# EAGLE design rgxb (EAGLE 5.11)
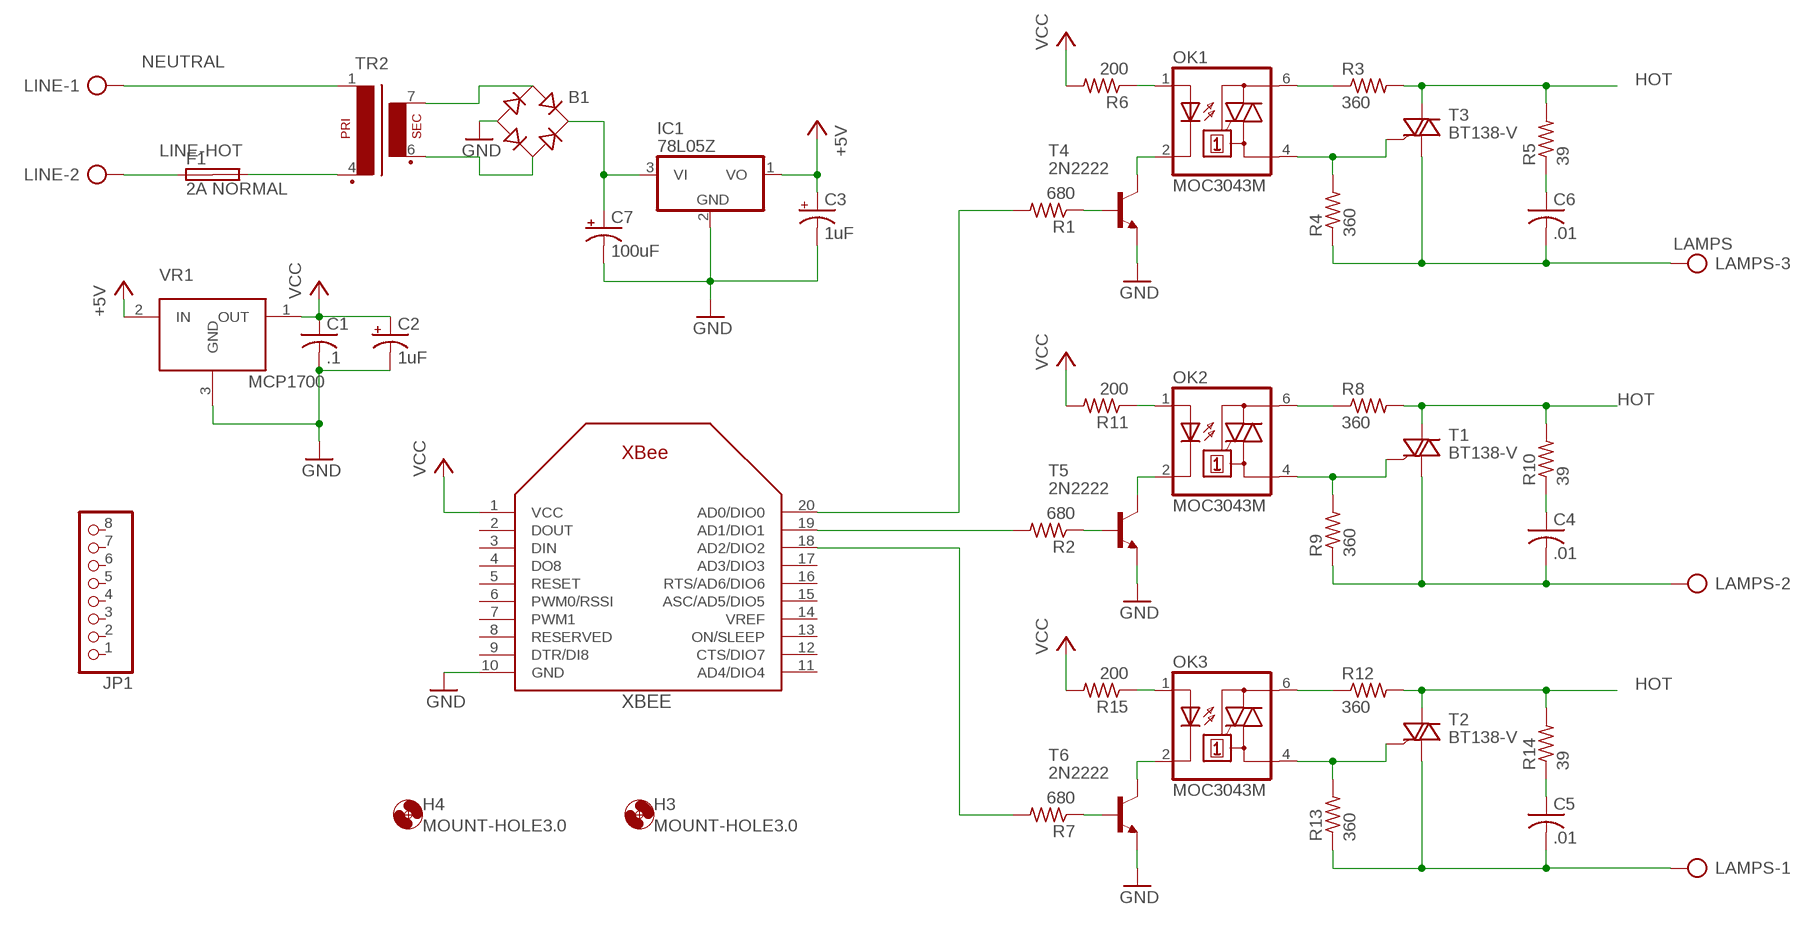
[diagram p0: schematic, sheet 1]

## Parts
B1  RB1A  [RB1A]
C1  .1  C-US025-025X050  [C025-025X050]
C2  1uF  CPOL-USE2.5-5  [E2,5-5]
C3  1uF  CPOL-USE2.5-5  [E2,5-5]
C4  .01  C-US050-025X075  [C050-025X075]
C5  .01  C-US050-025X075  [C050-025X075]
C6  .01  C-US050-025X075  [C050-025X075]
C7  100uF  CPOL-USE5-10.5  [E5-10,5]
F1  2A NORMAL  SH32  [SH32]
H3  MOUNT-HOLE3.0  [3,0]
H4  MOUNT-HOLE3.0  [3,0]
IC1  78L05Z  [TO92]
JP1  PINHD-1X8  [1X08]
LAMPS  LAMPS  AK300/3  [AK300/3]
LINE  AK300/2  [AK300/2]
OK1  MOC3043M  [DIL06]
OK2  MOC3043M  [DIL06]
OK3  MOC3043M  [DIL06]
R1  680  R-US_0204/5  [0204/5]
R2  680  R-US_0204/5  [0204/5]
R3  360  R-US_0204/5  [0204/5]
R4  360  R-US_0309/10  [0309/10]
R5  39  R-US_0204/5  [0204/5]
R6  200  R-US_0204/5  [0204/5]
R7  680  R-US_0204/5  [0204/5]
R8  360  R-US_0204/5  [0204/5]
R9  360  R-US_0309/10  [0309/10]
R10  39  R-US_0204/5  [0204/5]
R11  200  R-US_0204/5  [0204/5]
R12  360  R-US_0204/5  [0204/5]
R13  360  R-US_0309/10  [0309/10]
R14  39  R-US_0204/5  [0204/5]
R15  200  R-US_0204/5  [0204/5]
T1  BT138-V  [TO220BV]
T2  BT138-V  [TO220BV]
T3  BT138-V  [TO220BV]
T4  2N2222  2N2222-NPN-TO92-EBC  [TO92-EBC]
T5  2N2222  2N2222-NPN-TO92-EBC  [TO92-EBC]
T6  2N2222  2N2222-NPN-TO92-EBC  [TO92-EBC]
TR2  EE20-1  [EE20-1]
VR1  MCP1700  [TO-92]
XBEE  XBEE  [XBEE]

## Nets
+5V: C3.+ IC1.1(VO) VR1.2(IN)
GND: B1.- C1.2 C2.- C3.- C7.- IC1.2(GND) T4.E T5.E T6.E VR1.3(GND) XBEE.10(GND)
HOT: F1.2A R3.2 R5.2 R8.2 R10.2 R12.2 R14.2 T1.T2(A2) T2.T2(A2) T3.T2(A2) TR2.4(P2)
LINE-HOT: F1.1A LINE.2
N$1: OK1.1(A) R6.1
N$2: OK1.6(A2) R3.1
N$3: OK1.4(A1) R4.2 T3.G
N$4: R1.2 XBEE.20(AD0/DIO0)
N$5: R2.2 XBEE.19(AD1/DIO1)
N$6: C6.2 LAMPS.3 R4.1 T3.T1(A1)
N$7: B1.AC1 TR2.7(S4)
N$8: B1.AC2 TR2.6(S3)
N$9: R1.1 T4.B
N$10: C6.1 R5.1
N$11: OK1.2(C) T4.C
N$12: R2.1 T5.B
N$13: OK2.1(A) R11.1
N$14: R7.2 XBEE.18(AD2/DIO2)
N$15: OK2.6(A2) R8.1
N$16: OK2.4(A1) R9.2 T1.G
N$17: C4.2 LAMPS.2 R9.1 T1.T1(A1)
N$18: C4.1 R10.1
N$19: OK3.1(A) R15.1
N$20: OK3.6(A2) R12.1
N$21: R7.1 T6.B
N$22: OK3.4(A1) R13.2 T2.G
N$23: C5.2 LAMPS.1 R13.1 T2.T1(A1)
N$24: C5.1 R14.1
N$25: OK3.2(C) T6.C
N$26: OK2.2(C) T5.C
NEUTRAL: LINE.1 TR2.1
SOURCE+: B1.+ C7.+ IC1.3(VI)
VCC: C1.1 C2.+ R6.2 R11.2 R15.2 VR1.1(OUT) XBEE.1(VCC)
Unconnected: F1.1B F1.2B JP1.1 JP1.2 JP1.3 JP1.4 JP1.5 JP1.6 JP1.7 JP1.8 XBEE.2(DOUT) XBEE.3(DIN) XBEE.4(DO8) XBEE.5(RESET) XBEE.6(PWM0/RSSI) XBEE.7(PWM1) XBEE.8(RESERVED) XBEE.9(DTR/DI8) XBEE.11(AD4/DIO4) XBEE.12(CTS/DIO7) XBEE.13(ON/SLEEP) XBEE.14(VREF) XBEE.15(ASC/AD5/DIO5) XBEE.16(RTS/AD6/DIO6) XBEE.17(AD3/DIO3)

## Library data of the parts
B1 = rectifier:RB1A: RECTIFIER 1 A
C1 = rcl-ez:C-US: CAPACITOR, American symbol
C2 C3 = rcl-ez:CPOL-US: POLARIZED CAPACITOR, American symbol
C4-C6 = rcl:C-US: CAPACITOR, American symbol
C7 = rcl:CPOL-US: POLARIZED CAPACITOR, American symbol
F1 = fuse:SH32: FUSE HOLDER 6 x 32 mm, SH contact, SHH3N Schukat, 102071 Wickmann (Buerklin); MPN: 10207101009; OC_FARNELL: 811786; OC_NEWARK: 76R6904
H3 H4 = holes:MOUNT-HOLE: MOUNTING HOLE with drill center marker
IC1 = linear:78*: Positive VOLTAGE REGULATOR Source: http://cache.national.com/ds/LM/LM78L05.pdf http://www.fairchildsemi.com/ds/LM/LM7805.pdf
JP1 = pinhead:PINHD-1X8: PIN HEADER
LAMPS = con-ptr500:AK300/3: CONNECTOR; OC_FARNELL: unknown; OC_NEWARK: unknown
LINE = con-ptr500:AK300/2: CONNECTOR; OC_FARNELL: unknown; OC_NEWARK: unknown
OK1-OK3 = optocoupler:MOC30*: 6-Pin DIP Zero-Cross Optoisolators Triac Driver Output (250/400 Volt Peak) Source: http://www.fairchildsemi.com/ds/MO/MOC3043-M.pdf
R1 R2 R5-R7 R10 R11 R14 R15 = rcl:R-US_: RESISTOR, American symbol
R3 R4 R8 R9 R12 R13 = resistor:R-US_: RESISTOR, American symbol
T1-T3 = triac:BT138: TRIAC Source: http://www.semiconductors.philips.com BT138_SERIES_2.pdf
T4-T6 = transistor-neu-to92:*-NPN-: NPN Transistror
TR2 = trafo:EE20-1: TRANSFORMER 1 primary winding, 1 secondary winding ERA
VR1 = merriman:MCP1700: Microchip LDO regulator
XBEE = ulink:XBEE

## Board
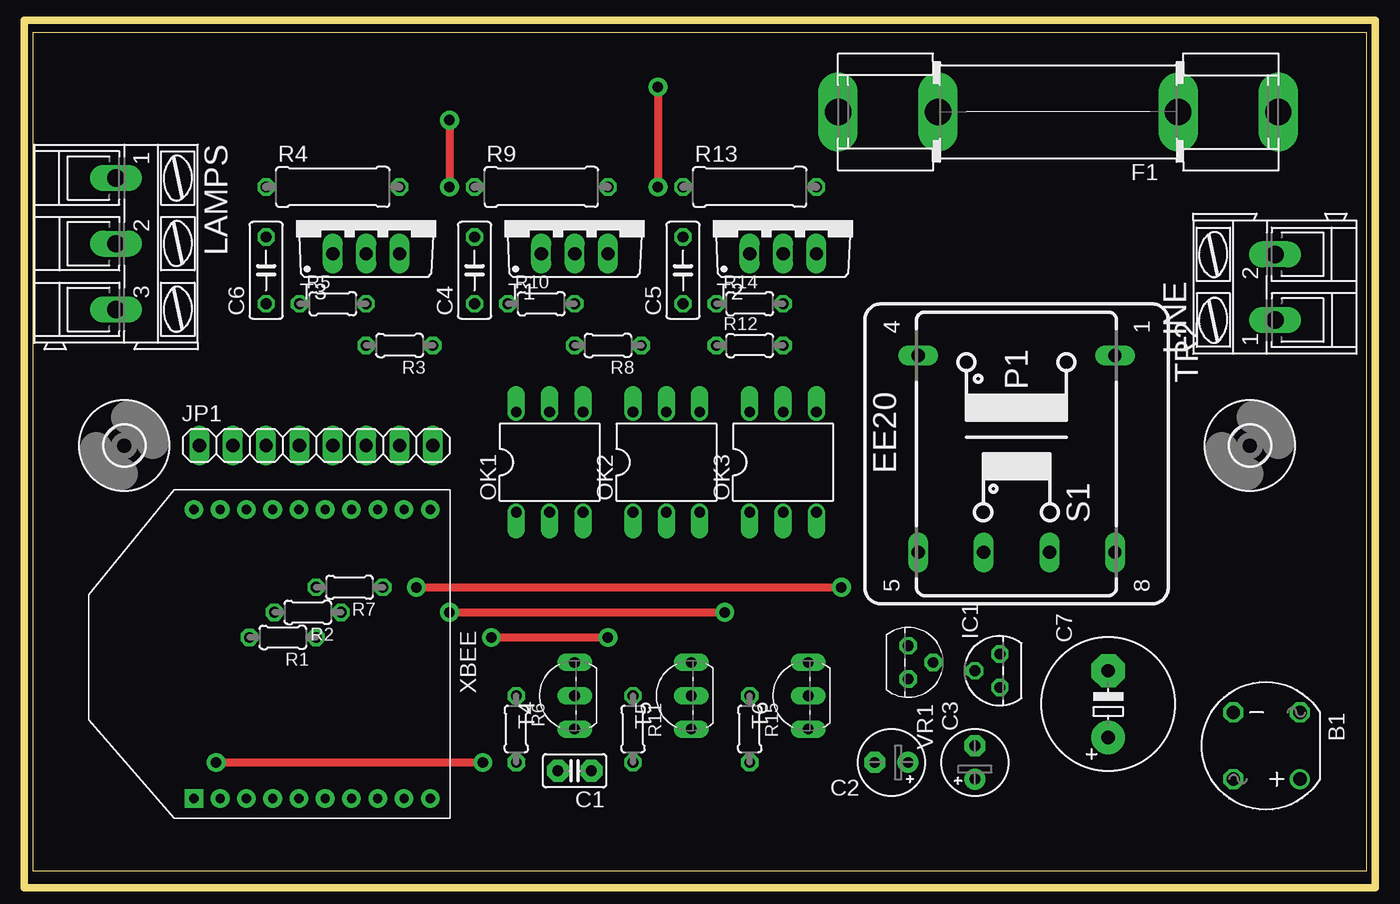
[diagram p1: board, top side]
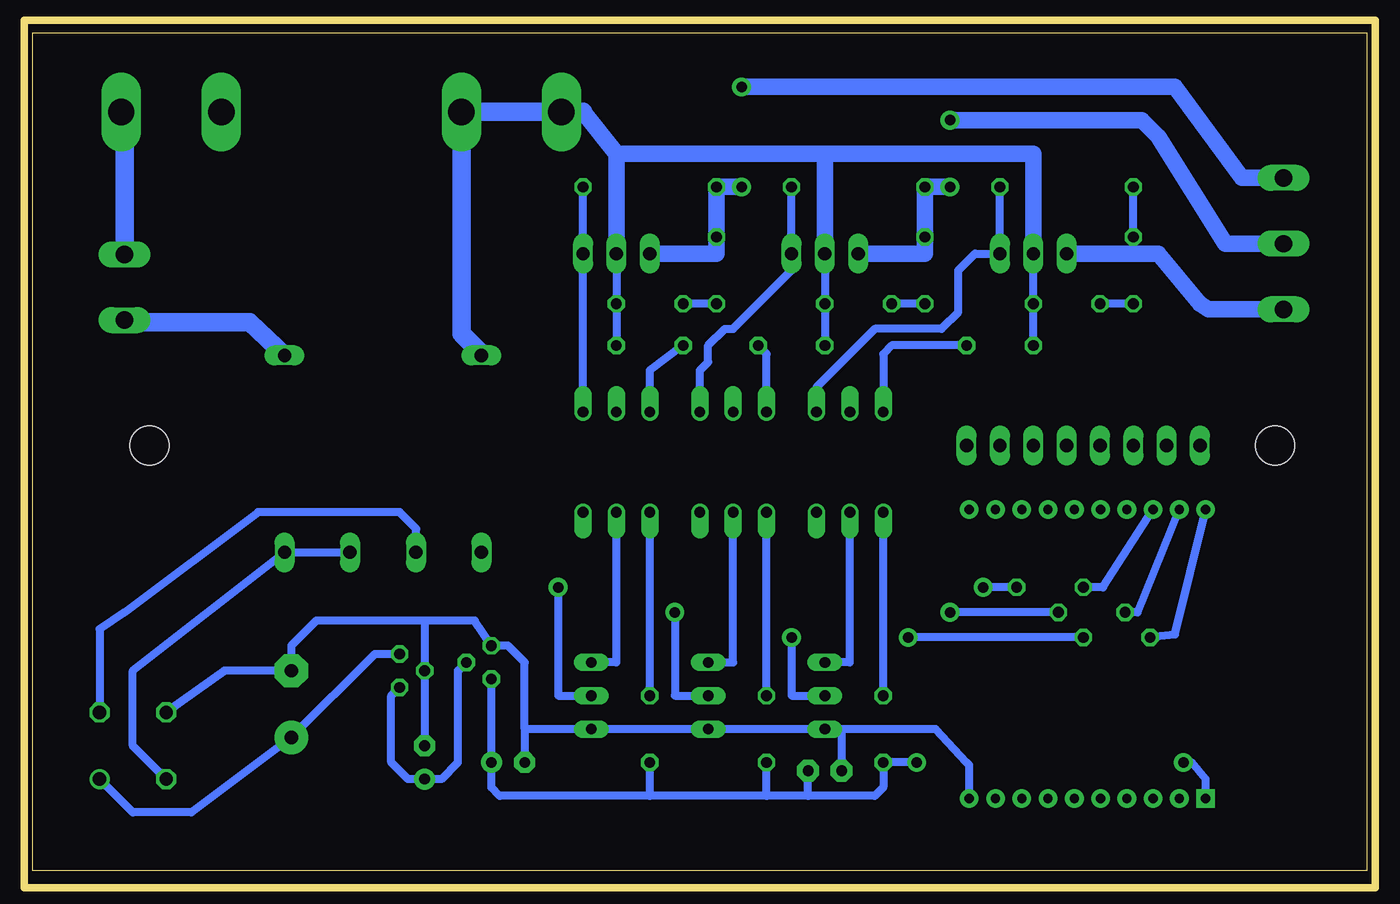
[diagram p2: board, bottom side, seen from below]

Size 101.59 x 63.8 mm. Coordinates in mm from the lower left corner, seen from the top.
Outline: 101.59,0 101.59,63.8 0,63.8 0,0 101.59,0
Copper layers (1*16): Top 0.035mm / dielectric 1.5mm / Bottom 0.035mm
Design rules "default *": minimum track width 20mil, minimum drill 24mil, track to track 22mil, track to pad 22mil, pad to pad 22mil, via to via 8mil, smd to smd 20mil, copper to edge 0mil, drill to drill 16mil, minimum pad ring 10mil, minimum via ring 8mil, stop-mask expansion 4mil, vias tented up to drill 0mil, thermal gap 10mil
Milling: 4 lines

### Footprints (pad centres in the part's own frame; a part is rotated, then mirrored left to right if it is on the bottom)
RB1A = drill 1.016 round: + -2.54,2.54 | drill 1.016 octagon: - 2.54,-2.54; AC1 2.54,2.54; AC2 -2.54,-2.54
C025-025X050 = drill 0.813 pad 1.676 octagon: 1 -1.27,0; 2 1.27,0
E2,5-5 = drill 0.813 pad 1.6 round: + -1.27,0 | drill 0.813 pad 1.6 octagon: - 1.27,0
C050-025X075 = drill 0.813 octagon: 1 -2.54,0; 2 2.54,0
E5-10,5 = drill 1.016 pad 2.54 round: + -2.54,0 | drill 1.016 pad 2.54 octagon: - 2.54,0
SH32 = drill 2.007 long: 1A -16.764,0; 1B -9.144,0; 2A 9.144,0; 2B 16.764,0
3,0 = hole 3: 0,0
TO92 = drill 0.813 octagon: 1 -1.27,0; 2 0,1.905; 3 1.27,0
1X08 = drill 1.016 long: 1 -8.89,0; 2 -6.35,0; 3 -3.81,0; 4 -1.27,0; 5 1.27,0; 6 3.81,0; 7 6.35,0; 8 8.89,0
AK300/3 = drill 1.321 long: 1 -5.004,0; 2 0,0; 3 5.004,0
AK300/2 = drill 1.321 long: 1 -2.515,0; 2 2.489,0
DIL06 = drill 0.813 offset: 1 -2.54,-3.81; 2 0,-3.81; 3 2.54,-3.81; 4 2.54,3.81; 5 0,3.81; 6 -2.54,3.81
0204/5 = drill 0.813 octagon: 1 -2.54,0; 2 2.54,0
0309/10 = drill 0.813 octagon: 1 -5.08,0; 2 5.08,0
TO220BV = drill 1.016 long: G 2.54,-2.54; T1 -2.54,-2.54; T2 0,-2.54
TO92-EBC = drill 0.813 long: B 0,-1.27; C 2.54,-1.27; E -2.54,-1.27
EE20-1 = drill 1.016 long: 1 -7.493,7.493; 4 -7.493,-7.493; 5 7.493,-7.493; 6 7.493,-2.515; 7 7.493,2.515; 8 7.493,7.493
TO-92 = drill 0.813 octagon: 1 1.27,0; 2 0,1.905; 3 -1.27,0
XBEE = drill 0.7 pad 1.422 square: 1 -11,5.5 | drill 0.7 pad 1.422 round: 2 -11,3.5; 3 -11,1.5; 4 -11,-0.5; 5 -11,-2.5; 6 -11,-4.5; 7 -11,-6.5; 8 -11,-8.5; 9 -11,-10.5; 10 -11,-12.5; 11 11,-12.5; 12 11,-10.5; 13 11,-8.5; 14 11,-6.5; 15 11,-4.5; 16 11,-2.5; 17 11,-0.5; 18 11,1.5; 19 11,3.5; 20 11,5.5

### Placement (x,y rotation side)
B1  93.97,9.53 180 top
C1  41.27,7.62 180 top
C2  65.39,8.26 180 top
C3  71.74,8.26 90 top
C4  33.65,45.72 90 top
C5  49.52,45.72 90 top
C6  17.77,45.72 90 top
C7  81.91,12.7 90 top
F1  78.09,57.78 180 top
H3  92.7,32.38 0 top
H4  6.98,32.38 0 top
IC1  73.65,15.24 90 top
JP1  21.58,32.38 0 top
LAMPS  6.34,47.75 270 top
LINE  94.6,44.45 90 top
OK1  39.36,31.11 0 top
OK2  48.25,31.11 0 top
OK3  57.14,31.11 0 top
R1  19.04,17.78 180 top
R2  20.94,19.68 180 top
R3  27.93,40.01 180 top
R4  22.85,52.07 0 top
R5  22.85,43.18 0 top
R6  36.82,10.79 270 top
R7  24.12,21.59 180 top
R8  43.8,40.01 180 top
R9  38.73,52.07 0 top
R10  38.73,43.18 0 top
R11  45.71,10.79 270 top
R12  54.6,40.01 0 top
R13  54.6,52.07 0 top
R14  54.6,43.18 0 top
R15  54.6,10.79 270 top
T1  41.27,49.53 0 top
T2  57.14,49.53 0 top
T3  25.39,49.53 0 top
T4  40,13.34 90 top
T5  48.89,13.34 90 top
T6  57.77,13.34 90 top
TR2  74.92,31.75 270 top
VR1  66.66,15.88 270 top
XBEE  17.77,16.51 90 top

### Tracks (layer width: path | path; a pad name or v marks a point on that pad's centre or on a via)
+5V
  Bottom 0.61: IC1.1 74.28,13.34 74.28,8.26 73.02,6.99 C3.+ 70.47,6.99 69.2,8.26 69.2,15.24 VR1.2
GND
  Bottom 0.61: 64.12,10.79 C2.- | 40,10.79 32.81,10.79 30.47,8.26 30.27,8.05 XBEE.10 | 40,10.79 T4.E T5.E T6.E 64.12,10.79 | C3.- IC1.2 71.74,19.05 | 40,10.79 C1.2 | B1.- 86.98,15.24 C7.- 81.91,17.14 80,19.05 71.74,19.05 | 71.74,19.05 67.93,19.05 VR1.3 65.39,17.14 64.12,15.88 64.12,10.79
HOT
  Bottom 0.406: TR2.4 67.3,39.24 67.3,38.73
  Bottom 0.61: T3.T2 R5.2 R3.2 | T2.T2 R14.2 R12.2 | T1.T2 R10.2 R8.2
  Bottom 1.27: T3.T2 25.39,54.61 41.27,54.61 | 41.27,54.61 T1.T2 | 41.27,54.61 57.14,54.61 | 57.14,54.61 T2.T2 | 57.14,54.61 59.68,57.78
  Bottom 1.422: 59.68,57.78 F1.2A 68.95,40.89 67.3,39.24
LINE-HOT
  Bottom 1.422: LINE.2 94.6,57.53
  Bottom 1.676: 94.6,57.53 F1.1A
N$1
  Bottom 0.61: R6.1 OK1.1
N$2
  Bottom 0.61: OK1.6 36.82,39.37 36.19,40.01 R3.1
N$3
  Bottom 0.61: R4.2 T3.G 29.83,46.99 31.1,45.72 31.1,42.55 32.38,41.27 37.46,41.27 41.9,36.83 OK1.4
N$4
  Bottom 0.61: XBEE.20 14.6,17.98 R1.2
N$5
  Bottom 0.61: R2.2 17.44,19.68 XBEE.19
N$6
  Bottom 0.61: 17.77,46.99 C6.2 R4.1
  Bottom 1.27: T3.T1 17.77,46.99 15.87,46.99 12.69,43.18 12.05,42.75 LAMPS.3
N$7
  Bottom 0.61: B1.AC1 93.97,9.53 93.97,15.24 82.54,24.13 82.41,24.26 TR2.7
N$8
  Bottom 0.61: B1.AC2 96.51,18.41 94.6,19.68 84.44,27.3 73.65,27.3 72.38,26.04 72.41,26.01 TR2.6
N$9  (via drill 0.8 pad 1.42)
  Top 0.61: v34.91,17.78 v43.8,17.78
  Bottom 0.61: R1.1 v34.91,17.78 | v43.8,17.78 43.8,13.34 T4.B
N$10
  Bottom 0.61: C6.1 R5.1
N$11
  Bottom 0.61: T4.C 39.36,15.88 OK1.2
N$12  (via drill 0.8 pad 1.42)
  Top 0.61: v31.74,19.68 v52.7,19.68
  Bottom 0.61: R2.1 v31.74,19.68 | v52.7,19.68 52.7,13.34 T5.B
N$13
  Bottom 0.61: R11.1 OK2.1
N$14
  Bottom 0.61: R7.2 20.08,21.59 XBEE.18
N$15
  Bottom 0.61: OK2.6 45.71,39.37 R8.1
N$16
  Bottom 0.61: R9.2 T1.G 43.8,45.72 48.25,41.27 48.89,41.27 50.16,40.01 50.16,38.73 50.79,38.1 OK2.4
N$17  (via drill 0.8 pad 1.42)
  Top 0.61: v31.74,57.15 v31.74,52.07
  Bottom 1.27: T1.T1 33.65,46.99 C4.2 R9.1 v31.74,52.07 | LAMPS.2 10.79,47.75 15.87,55.88 17.13,57.15 v31.74,57.15
N$18
  Bottom 0.61: C4.1 R10.1
N$19
  Bottom 0.61: R15.1 OK3.1
N$20
  Bottom 0.61: OK3.6 54.6,38.1 R12.1
N$21  (via drill 0.8 pad 1.42)
  Top 0.61: v29.2,21.59 v61.59,21.59
  Bottom 0.61: R7.1 v29.2,21.59 | v61.59,21.59 61.59,13.34 T6.B
N$22
  Bottom 0.61: R13.2 T2.G OK3.4
N$23  (via drill 0.8 pad 1.42)
  Top 0.61: v47.62,59.69 v47.62,52.07
  Bottom 1.27: T2.T1 49.52,46.99 C5.2 R13.1 v47.62,52.07 | LAMPS.1 9.52,52.76 14.6,59.69 v47.62,59.69
N$24
  Bottom 0.61: C5.1 R14.1
N$25
  Bottom 0.61: T6.C 57.14,15.88 OK3.2
N$26
  Bottom 0.61: T5.C 48.25,15.88 OK2.2
NEUTRAL
  Bottom 1.27: 94.6,41.78 LINE.1
  Bottom 1.422: TR2.1 85.08,41.78 94.6,41.78
SOURCE+
  Bottom 0.61: IC1.3 75.55,16.51 C7.+ 89.52,4.45 93.97,4.45 B1.+
VCC  (via drill 0.8 pad 1.42)
  Top 0.61: v13.96,8.26 v34.28,8.26
  Bottom 0.61: v34.28,8.26 R6.2 36.82,6.35 37.46,5.71 42.54,5.71 | 42.54,5.71 45.71,5.71 | 45.71,5.71 R11.2 | 54.6,5.71 R15.2 | 45.71,5.71 54.6,5.71 | 54.6,5.71 66.03,5.71 66.66,6.35 C2.+ VR1.1 | 42.54,5.71 C1.1 | v13.96,8.26 13.33,8.26 12.27,6.99 XBEE.1